# EAGLE design door optocoupler (EAGLE 5.11)
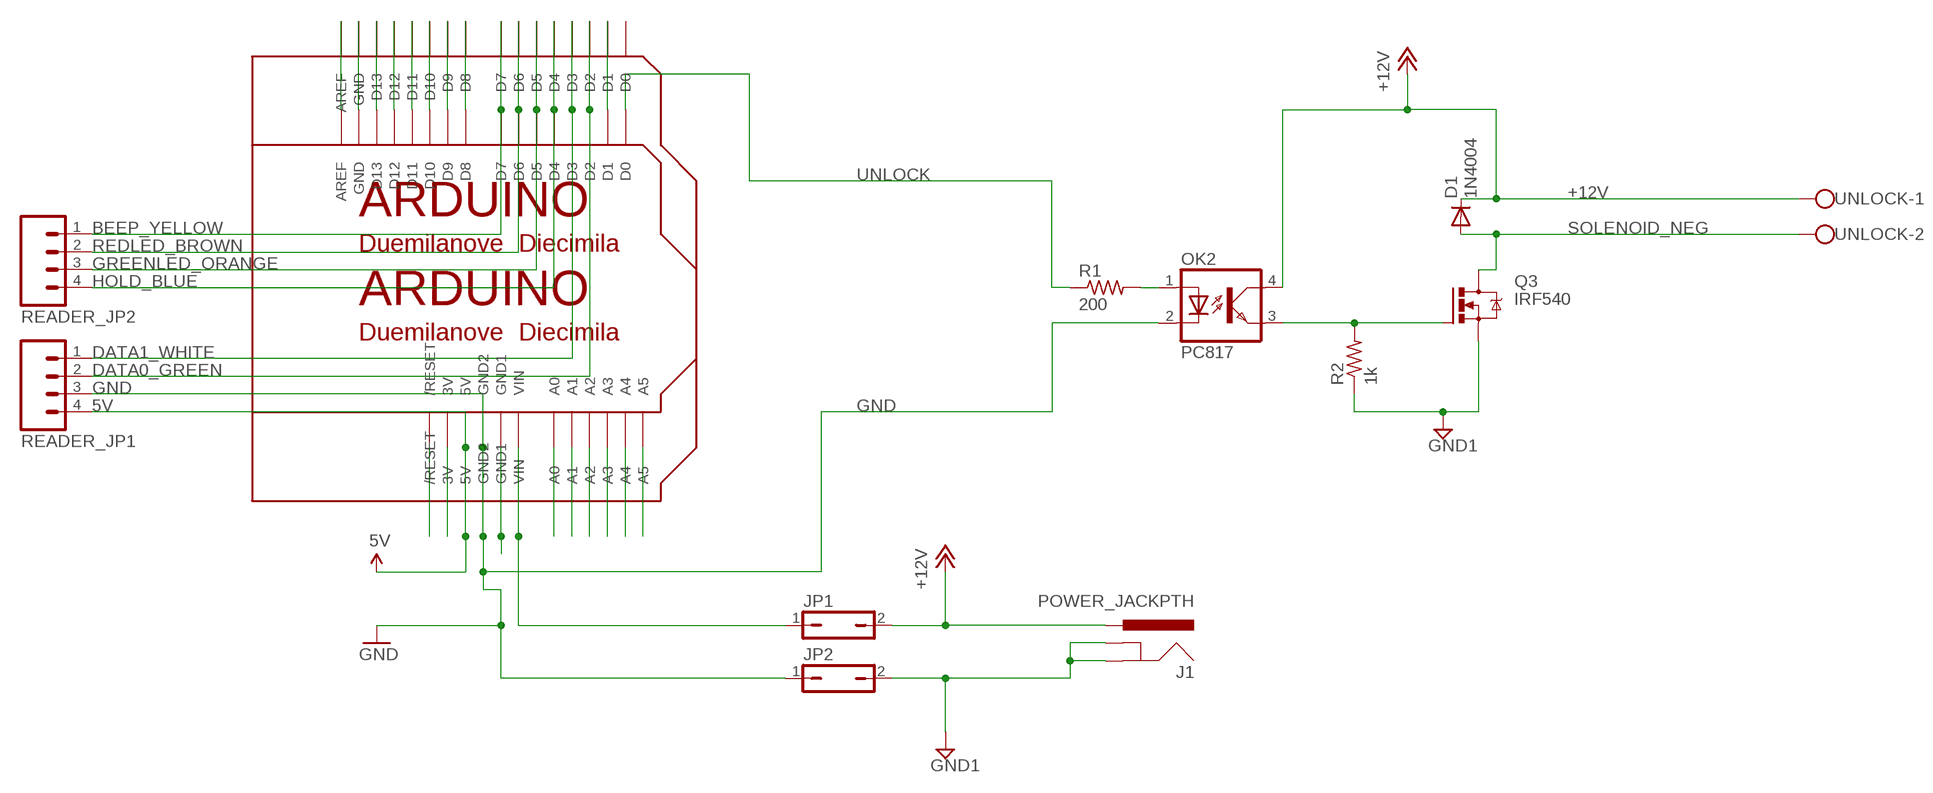
[diagram p0: schematic, sheet 1]

## Parts
BOTTOMCONNECT  ARDUINOUNO  [ARDUINO]
D1  1N4004  [DO41-10]
J1  POWER_JACKPTH  [POWER_JACK_PTH]
JP1  JP1Q  [JP1]
JP2  JP1Q  [JP1]
OK2  PC817  [DIL04]
Q3  IRF540  [TO220BV]
R1  200  R-US_0207/10  [0207/10]
R2  1k  R-US_0207/10  [0207/10]
READER_JP1  M04SCREW  [SCREWTERMINAL-3.5MM-4]
READER_JP2  M04SCREW  [SCREWTERMINAL-3.5MM-4]
TOPCONNECT  ARDUINOUNO  [ARDUINO]
UNLOCK  W237-102  [W237-102]

## Nets
5V: BOTTOMCONNECT.5V READER_JP1.4 TOPCONNECT.5V
+12V: D1.C J1.PWR JP1.2 OK2.4(COL) UNLOCK.1
BEEP_YELLOW: BOTTOMCONNECT.D7 READER_JP2.1 TOPCONNECT.D7
DATA0_GREEN: BOTTOMCONNECT.D2 READER_JP1.2 TOPCONNECT.D2
DATA1_WHITE: BOTTOMCONNECT.D3 READER_JP1.1 TOPCONNECT.D3
GND: BOTTOMCONNECT.GND2 JP2.1 OK2.2(C) READER_JP1.3 TOPCONNECT.GND2
GND1: J1.GND J1.GNDBREAK JP2.2 Q3.S R2.1
GREENLED_ORANGE: BOTTOMCONNECT.D5 READER_JP2.3 TOPCONNECT.D5
HOLD_BLUE: BOTTOMCONNECT.D4 READER_JP2.4 TOPCONNECT.D4
N$1: OK2.1(A) R1.2
N$2: BOTTOMCONNECT.VIN JP1.1 TOPCONNECT.VIN
N$3: OK2.3(EMIT) Q3.G R2.2
N$4: BOTTOMCONNECT.GND1 TOPCONNECT.GND1
N$5: BOTTOMCONNECT.GND TOPCONNECT.GND
N$6: BOTTOMCONNECT.D13 TOPCONNECT.D13
N$7: BOTTOMCONNECT.D12 TOPCONNECT.D12
N$8: BOTTOMCONNECT.D11 TOPCONNECT.D11
N$9: BOTTOMCONNECT.D10 TOPCONNECT.D10
N$10: BOTTOMCONNECT.AREF TOPCONNECT.AREF
N$11: BOTTOMCONNECT.D9 TOPCONNECT.D9
N$12: BOTTOMCONNECT.D8 TOPCONNECT.D8
N$13: BOTTOMCONNECT.D1 TOPCONNECT.D1
N$14: BOTTOMCONNECT.3V TOPCONNECT.3V
N$15: BOTTOMCONNECT.RESET(/RESET) TOPCONNECT.RESET(/RESET)
N$16: BOTTOMCONNECT.A0 TOPCONNECT.A0
N$17: BOTTOMCONNECT.A1 TOPCONNECT.A1
N$18: BOTTOMCONNECT.A2 TOPCONNECT.A2
N$19: BOTTOMCONNECT.A3 TOPCONNECT.A3
N$20: BOTTOMCONNECT.A4 TOPCONNECT.A4
N$21: BOTTOMCONNECT.A5 TOPCONNECT.A5
REDLED_BROWN: BOTTOMCONNECT.D6 READER_JP2.2 TOPCONNECT.D6
SOLENOID_NEG: D1.A Q3.D UNLOCK.2
UNLOCK: BOTTOMCONNECT.D0 R1.1
Unconnected: TOPCONNECT.D0

## Library data of the parts
BOTTOMCONNECT TOPCONNECT = adafruit:ARDUINO: Arduino Diecimila/Duemilanove Make a shield with ease, this package has all the named pins as well as the two mounting drill holes and an outline of the USB and DC power connector. The outline is on the DIMENSION layer, so if your board house uses it they will cut the outline to match. http://www.ladyada.net/library/pcb/eaglelibrary.html
D1 = diode:1N4004: DIODE general purpose rectifier, 1 A
J1 = SparkFun:POWER_JACK: Power Jack This is the standard 5.5mm barrel jack for power. The PTH is the most common, proven, reliable, footprint. All others are experimental. The Slot footprint only works if the mill layer is transmitted to the PCB fab house so be warned. Spark Fun Electronics SKU : PRT-00119. Mating wall wart : TOL-00298 (and others)
JP1 JP2 = jumper:JP1Q: JUMPER
OK2 = optocoupler-2:PC817: SHARP OPTO COUPLER
Q3 = transistor-power:IRF540: HEXFET Power MOSFET
R1 R2 = rcl:R-US_: RESISTOR, American symbol
READER_JP1 READER_JP2 = SparkFun:M04: Header 4 Standard 4-pin 0.1" header. Use with straight break away headers (SKU : PRT-00116), right angle break away headers (PRT-00553), swiss pins (PRT-00743), machine pins (PRT-00117), and female headers (PRT-00115). Molex polarized connector foot print use with SKU : PRT-08231 with associated crimp pins and housings.
UNLOCK = con-wago-500:W237-102: WAGO SCREW CLAMP; MPN: 237-102; OC_FARNELL: unknown; OC_NEWARK: 70K9898

## Board
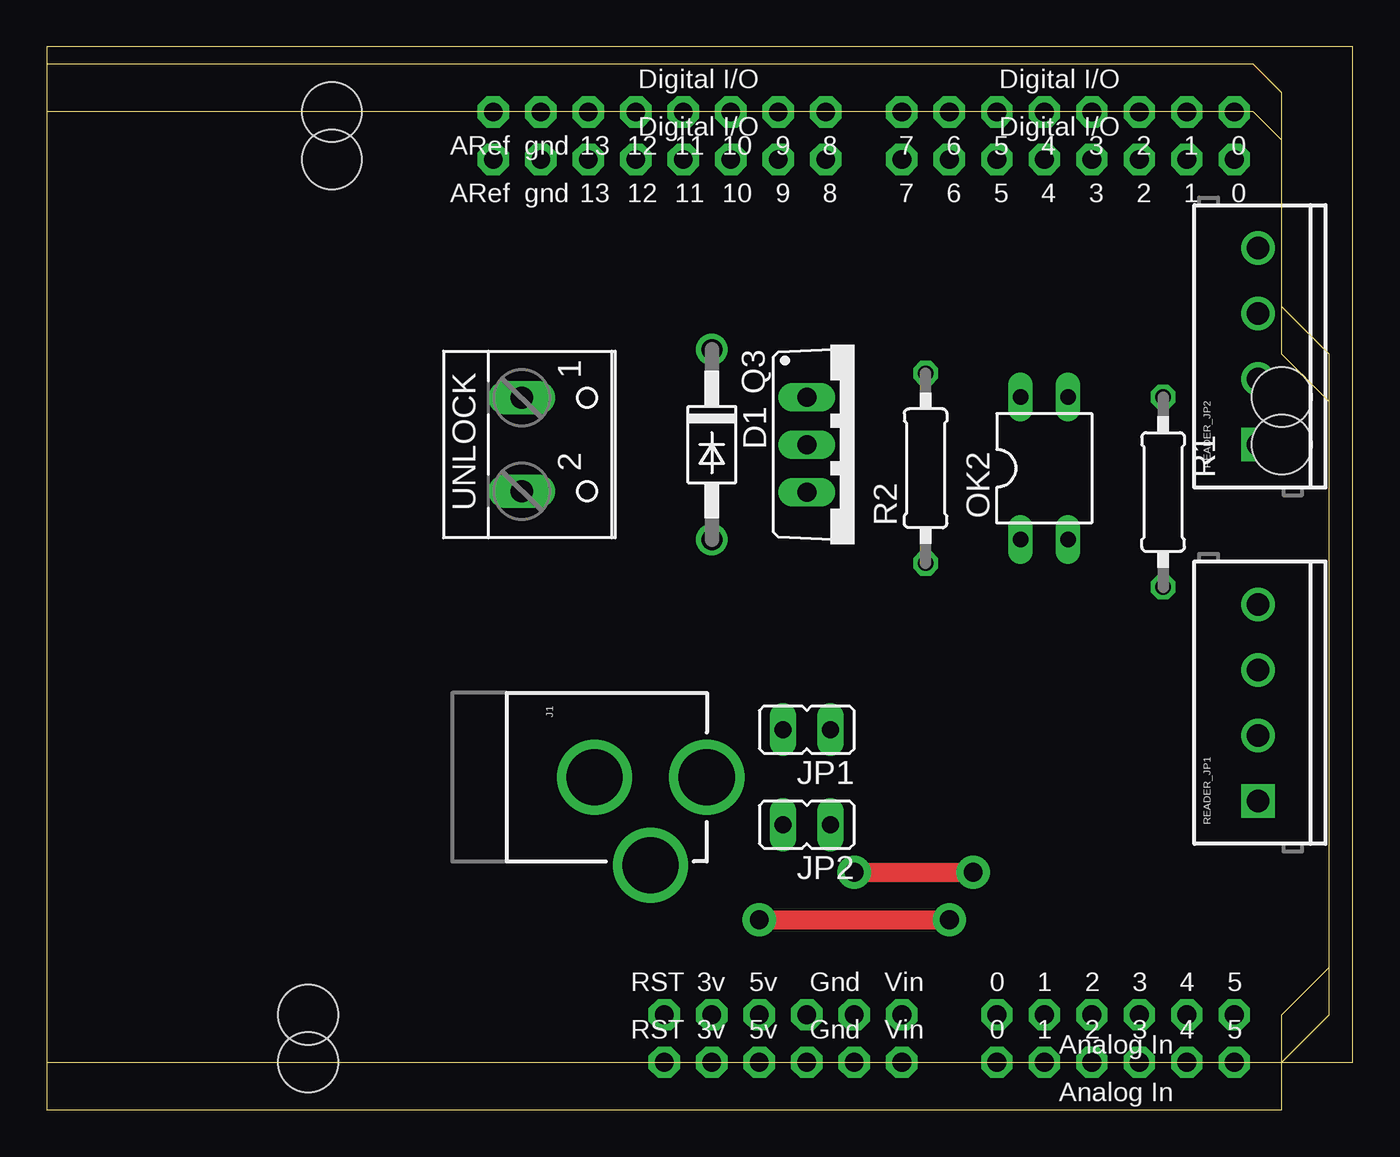
[diagram p1: board, top side]
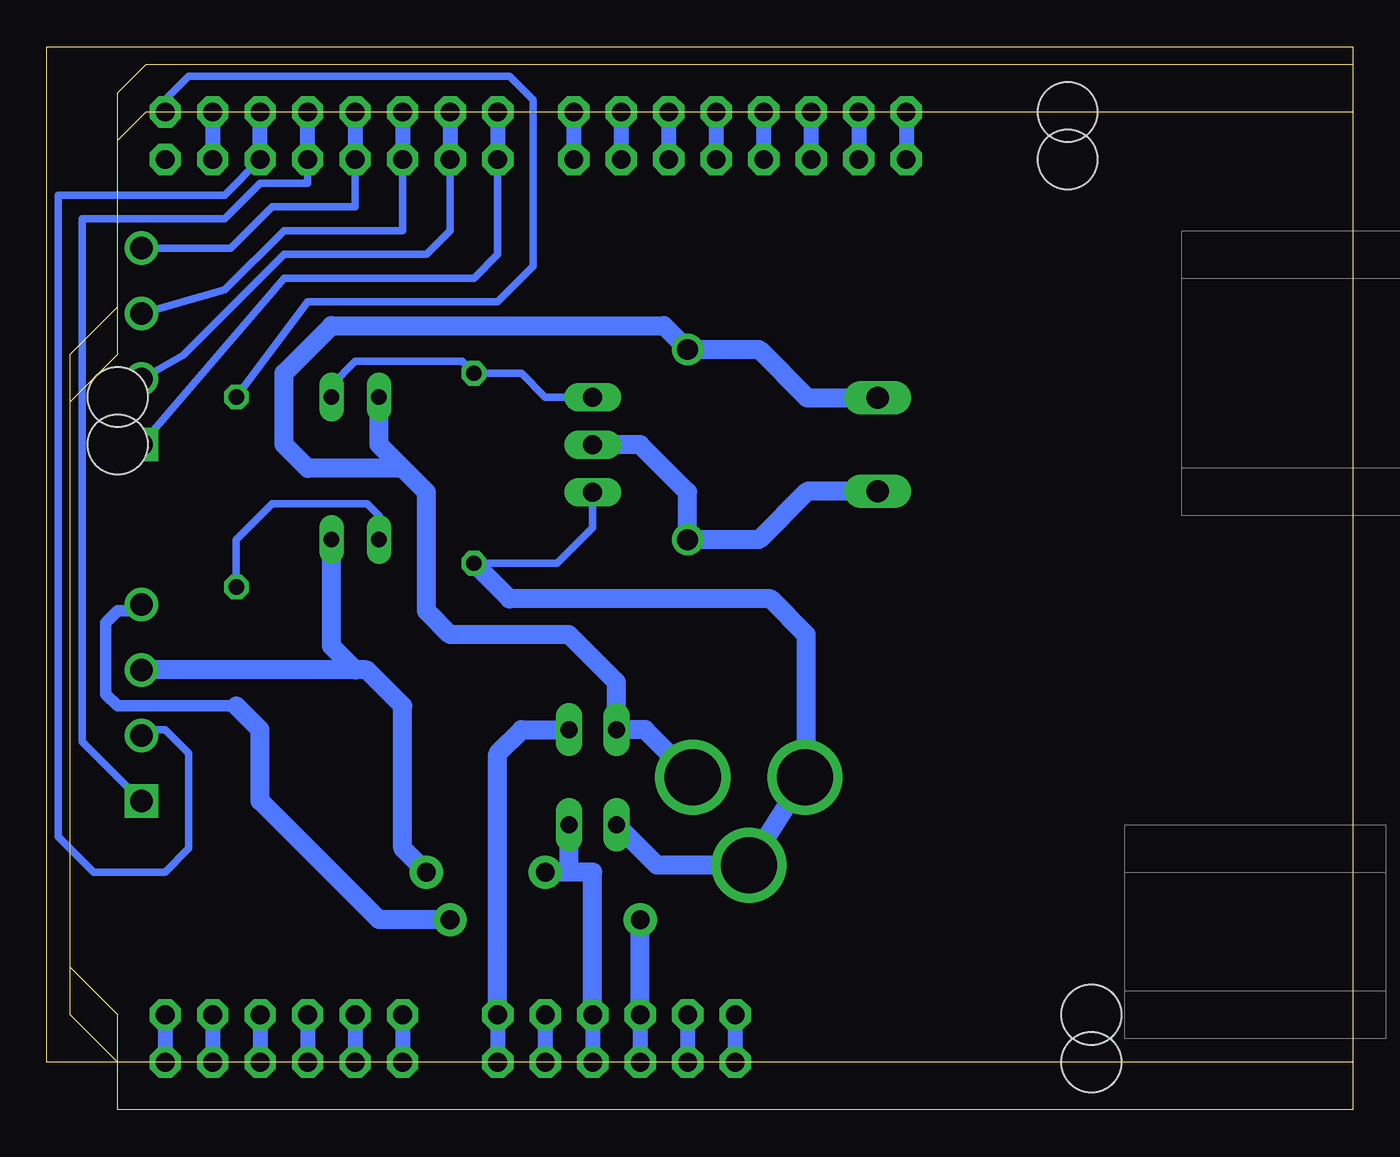
[diagram p2: board, bottom side, seen from below]

Size 69.83 x 54.28 mm. Coordinates in mm from the lower left corner, seen from the top.
Outline: 0,0 69.83,0 69.83,54.28 0,54.28 0,0
Copper layers (1*16): Top 0.035mm / dielectric 1.5mm / Bottom 0.035mm
Design rules "default": minimum track width 10mil, minimum drill 24mil, track to track 8mil, track to pad 8mil, pad to pad 8mil, via to via 8mil, smd to smd 8mil, copper to edge 40mil, drill to drill 8mil, minimum pad ring 10mil, minimum via ring 8mil, stop-mask expansion 4mil, vias tented up to drill 0mil, thermal gap 10mil

### Footprints (pad centres in the part's own frame; a part is rotated, then mirrored left to right if it is on the bottom)
ARDUINO = drill 1 pad 1.676 octagon: 3V 35.56,2.54; 5V 38.1,2.54; A0 50.8,2.54; A1 53.34,2.54; A2 55.88,2.54; A3 58.42,2.54; A4 60.96,2.54; A5 63.5,2.54; AREF 23.876,50.8; D0 63.5,50.8; D1 60.96,50.8; D2 58.42,50.8; D3 55.88,50.8; D4 53.34,50.8; D5 50.8,50.8; D6 48.26,50.8; D7 45.72,50.8; D8 41.656,50.8; D9 39.116,50.8; D10 36.576,50.8; D11 34.036,50.8; D12 31.496,50.8; D13 28.956,50.8; GND 26.416,50.8; GND1 43.18,2.54; GND2 40.64,2.54; RESET 33.02,2.54; VIN 45.72,2.54 | hole 3.2: 15.24,50.8; 66.04,35.56; 13.97,2.54
DO41-10 = drill 1.118 round: A 5.08,0; C -5.08,0
POWER_JACK_PTH = drill 2.997 round: GND 0,7.7; GNDBREAK 4.7,10.7; PWR 0,13.7
JP1 = drill 0.914 long: 1 0,-1.27; 2 0,1.27
DIL04 = drill 0.813 long: 1 -1.27,-3.81; 2 1.27,-3.81; 3 1.27,3.81; 4 -1.27,3.81
TO220BV = drill 1.016 long: D 0,-2.54; G -2.54,-2.54; S 2.54,-2.54
0207/10 = drill 0.813 octagon: 1 -5.08,0; 2 5.08,0
SCREWTERMINAL-3.5MM-4 = drill 1.2 square: 1 0,0 | drill 1.2 round: 2 3.5,0; 3 7,0; 4 10.5,0
W237-102 = drill 1.194 long: 1 -2.5,-1.27; 2 2.5,-1.27

### Placement (x,y rotation side)
BOTTOMCONNECT  0,0 0 top
D1  35.56,33.02 270 top
J1  21.59,15.24 270 top
JP1  40.64,17.78 90 top
JP2  40.64,12.7 90 top
OK2  53.34,31.75 0 top
Q3  43.18,33.02 270 top
R1  59.69,30.48 270 top
R2  46.99,31.75 90 top
READER_JP1  64.77,13.97 90 top
READER_JP2  64.77,33.02 90 top
TOPCONNECT  0,-2.54 0 top
UNLOCK  26.67,33.02 270 top

### Tracks (layer width: path | path; a pad name or v marks a point on that pad's centre or on a via)
5V  (via drill 1 pad 1.78)
  Top 1.016: v38.1,7.62 v48.26,7.62
  Bottom 0.61: 59.69,19.05 66.04,19.05 66.67,19.68 66.67,23.5 66.04,24.13 65.11,24.13 READER_JP1.4
  Bottom 0.813: BOTTOMCONNECT.5V TOPCONNECT.5V
  Bottom 1.016: BOTTOMCONNECT.5V v38.1,7.62 | v48.26,7.62 52.07,7.62 58.42,13.97 58.42,17.78 59.69,19.05
+12V
  Bottom 1.016: UNLOCK.1 29.17,35.52 31.75,38.1 D1.C 36.83,39.37 54.61,39.37 57.15,36.83 57.15,33.02 55.88,31.75 50.8,31.75 | J1.PWR 37.83,17.78 JP1.2 39.37,20.32 41.91,22.86 48.26,22.86 49.53,24.13 49.53,30.48 50.8,31.75 | 50.8,31.75 52.07,33.02 OK2.4
BEEP_YELLOW
  Bottom 0.406: READER_JP2.1 57.15,41.91 46.99,41.91 45.72,43.18 TOPCONNECT.D7
  Bottom 0.813: BOTTOMCONNECT.D7 TOPCONNECT.D7
DATA0_GREEN
  Bottom 0.406: TOPCONNECT.D2 60.33,46.35 69.22,46.35 69.22,12.06 67.31,10.16 63.5,10.16 62.23,11.43 62.23,16.51 63.5,17.78 64.46,17.78 READER_JP1.2
  Bottom 0.813: TOPCONNECT.D2 BOTTOMCONNECT.D2
DATA1_WHITE
  Bottom 0.406: READER_JP1.1 67.94,17.14 67.94,45.09 60.33,45.09 58.42,46.99 55.88,46.99 TOPCONNECT.D3
  Bottom 0.813: TOPCONNECT.D3 BOTTOMCONNECT.D3
GND  (via drill 1 pad 1.78)
  Top 1.016: v43.18,10.16 v49.53,10.16
  Bottom 0.813: BOTTOMCONNECT.GND2 TOPCONNECT.GND2
  Bottom 1.016: BOTTOMCONNECT.GND2 40.64,10.16 41.91,10.16 | 41.91,10.16 JP2.1 | 41.91,10.16 v43.18,10.16 | v49.53,10.16 50.8,11.43 50.8,19.05 52.72,20.97 53.34,20.97 | 53.34,20.97 READER_JP1.3 | OK2.2 54.61,22.24 53.34,20.97
GND1
  Bottom 0.406: R2.1 42.55,26.67 40.64,28.57 Q3.S
  Bottom 1.016: R2.1 45.09,24.77 31.11,24.77 29.21,22.86 29.21,15.24 J1.GND J1.GNDBREAK 37.21,10.54 JP2.2
GREENLED_ORANGE
  Bottom 0.406: READER_JP2.3 60.31,41.29 57.15,44.45 50.8,44.45 TOPCONNECT.D5
  Bottom 0.813: BOTTOMCONNECT.D5 TOPCONNECT.D5
HOLD_BLUE
  Bottom 0.406: READER_JP2.4 59.98,43.52 57.78,45.72 53.34,45.72 TOPCONNECT.D4
  Bottom 0.813: BOTTOMCONNECT.D4 TOPCONNECT.D4
N$1
  Bottom 0.406: OK2.1 52.07,29.21 52.7,29.84 57.78,29.84 59.69,27.94 R1.2
N$2
  Bottom 0.813: BOTTOMCONNECT.VIN TOPCONNECT.VIN
  Bottom 1.016: BOTTOMCONNECT.VIN 45.72,16.51 44.45,17.78 JP1.1
N$3
  Bottom 0.406: Q3.G 43.18,35.56 44.45,36.83 R2.2 47.62,37.47 53.34,37.47 54.61,36.2 OK2.3
N$4
  Bottom 0.813: BOTTOMCONNECT.GND1 TOPCONNECT.GND1
N$5
  Bottom 0.813: BOTTOMCONNECT.GND TOPCONNECT.GND
N$6
  Bottom 0.813: BOTTOMCONNECT.D13 TOPCONNECT.D13
N$7
  Bottom 0.813: BOTTOMCONNECT.D12 TOPCONNECT.D12
N$8
  Bottom 0.813: BOTTOMCONNECT.D11 TOPCONNECT.D11
N$9
  Bottom 0.813: BOTTOMCONNECT.D10 TOPCONNECT.D10
N$10
  Bottom 0.813: BOTTOMCONNECT.AREF TOPCONNECT.AREF
N$11
  Bottom 0.813: BOTTOMCONNECT.D9 TOPCONNECT.D9
N$12
  Bottom 0.813: BOTTOMCONNECT.D8 TOPCONNECT.D8
N$13
  Bottom 0.813: BOTTOMCONNECT.D1 TOPCONNECT.D1
N$14
  Bottom 0.813: BOTTOMCONNECT.3V TOPCONNECT.3V
N$15
  Bottom 0.813: BOTTOMCONNECT.RESET TOPCONNECT.RESET
N$16
  Bottom 0.813: BOTTOMCONNECT.A0 TOPCONNECT.A0
N$17
  Bottom 0.813: BOTTOMCONNECT.A1 TOPCONNECT.A1
N$18
  Bottom 0.813: BOTTOMCONNECT.A2 TOPCONNECT.A2
N$19
  Bottom 0.813: BOTTOMCONNECT.A3 TOPCONNECT.A3
N$20
  Bottom 0.813: BOTTOMCONNECT.A4 TOPCONNECT.A4
N$21
  Bottom 0.813: BOTTOMCONNECT.A5 TOPCONNECT.A5
REDLED_BROWN
  Bottom 0.406: READER_JP2.2 62.54,37.79 57.15,43.18 49.53,43.18 48.26,44.45 TOPCONNECT.D6
  Bottom 0.813: BOTTOMCONNECT.D6 TOPCONNECT.D6
SOLENOID_NEG
  Bottom 1.016: UNLOCK.2 29.17,30.52 31.75,27.94 D1.A 35.56,30.48 38.1,33.02 Q3.D
UNLOCK
  Bottom 0.406: R1.1 55.88,40.64 45.72,40.64 43.81,42.55 43.81,51.44 45.09,52.7 62.23,52.7 63.5,51.44 BOTTOMCONNECT.D0